# Altium schematic sheet 15_LCD.SchDoc
size A4
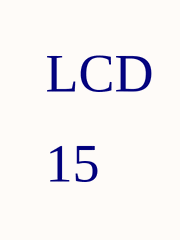
[diagram p0: 15_LCD.SchDoc]

## Notes on the sheet
- LCD
- 15